# EAGLE design voltage_board - itr2 - V3 (EAGLE 9.6.2)
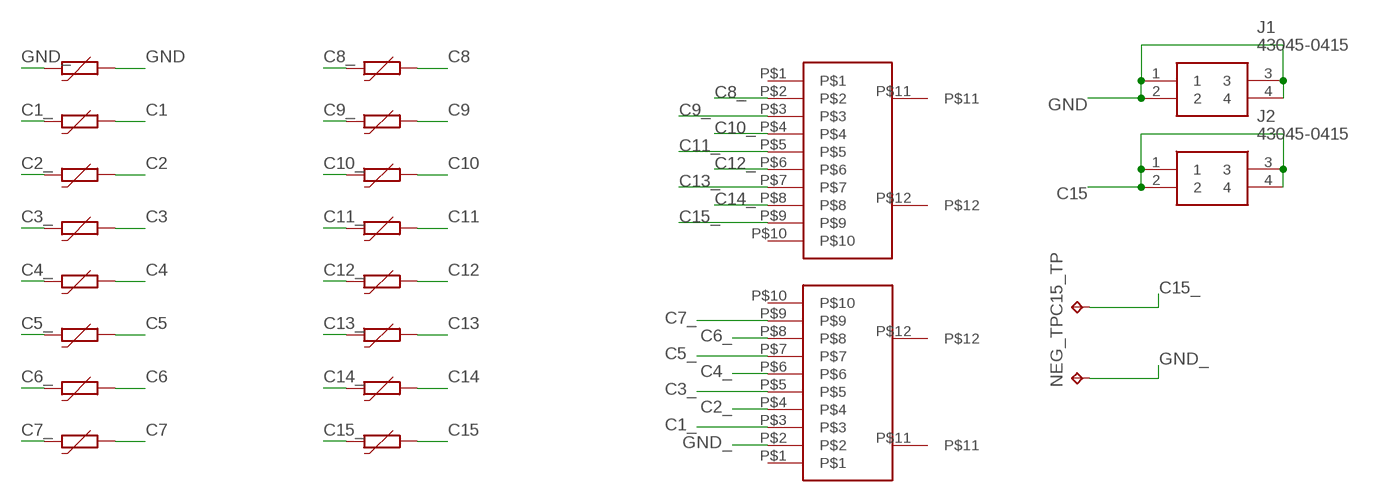
[diagram p0: schematic, sheet 1]

## Parts
C15_TP  TPPAD1-13  [P1-13]
GND_F  PTC-FUSE  [1206]
GND_F1  PTC-FUSE  [1206]
GND_F2  PTC-FUSE  [1206]
GND_F3  PTC-FUSE  [1206]
GND_F4  PTC-FUSE  [1206]
GND_F5  PTC-FUSE  [1206]
GND_F6  PTC-FUSE  [1206]
GND_F7  PTC-FUSE  [1206]
GND_F8  PTC-FUSE  [1206]
GND_F9  PTC-FUSE  [1206]
GND_F10  PTC-FUSE  [1206]
GND_F11  PTC-FUSE  [1206]
GND_F12  PTC-FUSE  [1206]
GND_F13  PTC-FUSE  [1206]
GND_F14  PTC-FUSE  [1206]
GND_F15  PTC-FUSE  [1206]
J1  43045-0415  [43045-04YY_15,16,17]
J2  43045-0415  [43045-04YY_15,16,17]
NEG_TP  TPPAD1-13  [P1-13]
U$37  VERTICALBMS10  [VERTICALBMS10]
U$38  VERTICALBMS10  [VERTICALBMS10]

## Nets
C1: GND_F1.2
C1_: GND_F1.1 U$37.P$3
C2: GND_F2.2
C2_: GND_F2.1 U$37.P$4
C3: GND_F3.2
C3_: GND_F3.1 U$37.P$5
C4: GND_F4.2
C4_: GND_F4.1 U$37.P$6
C5: GND_F5.2
C5_: GND_F5.1 U$37.P$7
C6: GND_F6.2
C6_: GND_F6.1 U$37.P$8
C7: GND_F7.2
C7_: GND_F7.1 U$37.P$9
C8: GND_F8.2
C8_: GND_F8.1 U$38.P$2
C9: GND_F9.2
C9_: GND_F9.1 U$38.P$3
C10: GND_F10.2
C10_: GND_F10.1 U$38.P$4
C11: GND_F11.2
C11_: GND_F11.1 U$38.P$5
C12: GND_F12.2
C12_: GND_F12.1 U$38.P$6
C13: GND_F13.2
C13_: GND_F13.1 U$38.P$7
C14: GND_F14.2
C14_: GND_F14.1 U$38.P$8
C15: GND_F15.2 J2.1 J2.2 J2.3 J2.4
C15_: C15_TP.TP GND_F15.1 U$38.P$9
GND: GND_F.2 J1.1 J1.2 J1.3 J1.4
GND_: GND_F.1 NEG_TP.TP U$37.P$2
Unconnected: U$37.P$1 U$37.P$10 U$37.P$11 U$37.P$12 U$38.P$1 U$38.P$10 U$38.P$11 U$38.P$12

## Library data of the parts
C15_TP NEG_TP = testpad:TP: Test pad
GND_F GND_F1-GND_F15 = IIT_BOMBAY_Racing:PTC-FUSE; MID: 0466.200NRHF
J1 J2 = 43045-0415:43045-0415: Micro-Fit 3.0 Vertical Header, 3.00mm Pitch, Dual Row, 4 Circuits, with PCB Press-fit Metal Retention Clip, Glow-Wire Capable Source: Datasheet <https://www.molex.com/pdm_docs/sd/430450416_sd.pdf>; DESCRIPTION: Micro-Fit 3.0 Vertical Header, 3.00mm Pitch, Dual Row, 4 Circuits, with PCB Press-fit Metal Retention Clip, Glow-Wire Capable; HEIGHT: 9.91mm; MANUFACTURER_NAME: Molex; MANUFACTURER_PART_NUMBER: 43045-0415; MOUSER_PART_NUMBER: 538-43045-0415; MOUSER_PRICE-STOCK: https://www.mouser.co.uk/ProductDetail/Molex/43045-0415?qs=jbJnFeK%2FK6yEAHtN9jCMQg%3D%3D
U$37 U$38 = IIT_BOMBAY_Racing2:VERTICALBMS10

## Board
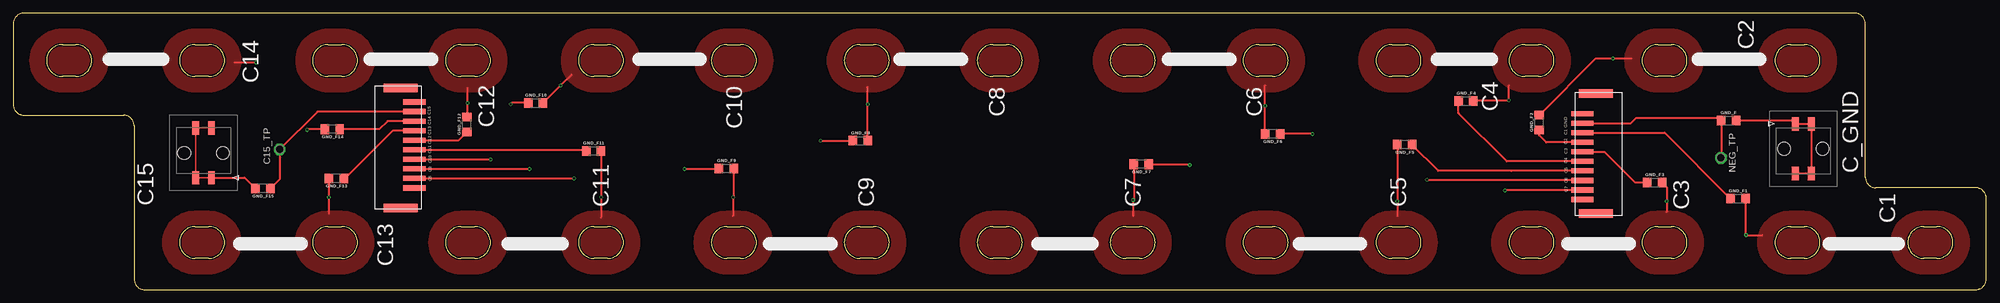
[diagram p1: board, top side]
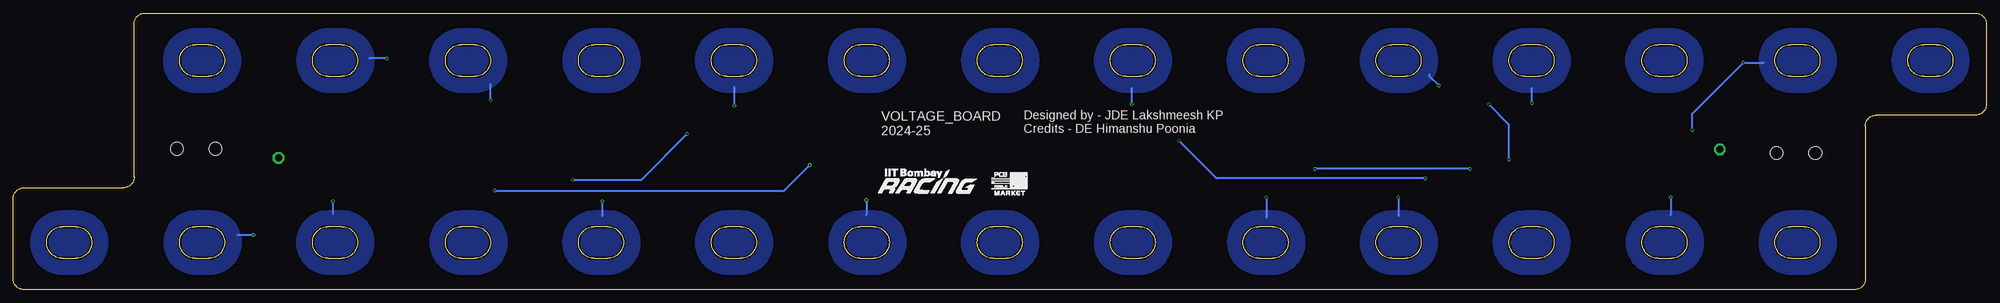
[diagram p2: board, bottom side, seen from below]

Size 372 x 52.1 mm. Coordinates in mm from the lower left corner, seen from the top.
Outline: 335.15,46.2 arc180 335.15,40.2 337.65,40.2 arc180 337.65,46.2 335.15,46.2
Outline: 287.52,40.2 arc180 287.52,46.2 285.02,46.2 arc180 285.02,40.2 287.52,40.2
Outline: 362.72,5.9 arc180 362.72,11.9 360.22,11.9 arc180 360.22,5.9 362.72,5.9
Outline: 312.58,40.2 arc180 312.58,46.2 310.08,46.2 arc180 310.08,40.2 312.58,40.2
Outline: 337.65,5.9 arc180 337.65,11.9 335.15,11.9 arc180 335.15,5.9 337.65,5.9
Outline: 310.08,11.9 arc180 310.08,5.9 312.58,5.9 arc180 312.58,11.9 310.08,11.9
Outline: 262.45,5.9 arc180 262.45,11.9 259.95,11.9 arc180 259.95,5.9 262.45,5.9
Outline: 285.02,11.9 arc180 285.02,5.9 287.52,5.9 arc180 287.52,11.9 285.02,11.9
Outline: 262.45,40.2 arc180 262.45,46.2 259.95,46.2 arc180 259.95,40.2 262.45,40.2
Outline: 34.35,46.2 arc180 34.35,40.2 36.85,40.2 arc180 36.85,46.2 34.35,46.2
Outline: 9.28,46.2 arc180 9.28,40.2 11.78,40.2 arc180 11.78,46.2 9.28,46.2
Outline: 112.05,40.2 arc180 112.05,46.2 109.55,46.2 arc180 109.55,40.2 112.05,40.2
Outline: 237.38,40.2 arc180 237.38,46.2 234.88,46.2 arc180 234.88,40.2 237.38,40.2
Outline: 234.88,11.9 arc180 234.88,5.9 237.38,5.9 arc180 237.38,11.9 234.88,11.9
Outline: 184.75,11.9 arc180 184.75,5.9 187.25,5.9 arc180 187.25,11.9 184.75,11.9
Outline: 134.62,46.2 arc180 134.62,40.2 137.12,40.2 arc180 137.12,46.2 134.62,46.2
Outline: 34.35,11.9 arc180 34.35,5.9 36.85,5.9 arc180 36.85,11.9 34.35,11.9
Outline: 86.98,5.9 arc180 86.98,11.9 84.48,11.9 arc180 84.48,5.9 86.98,5.9
Outline: 209.82,46.2 arc180 209.82,40.2 212.32,40.2 arc180 212.32,46.2 209.82,46.2
Outline: 187.25,40.2 arc180 187.25,46.2 184.75,46.2 arc180 184.75,40.2 187.25,40.2
Outline: 159.68,11.9 arc180 159.68,5.9 162.18,5.9 arc180 162.18,11.9 159.68,11.9
Outline: 112.05,5.9 arc180 112.05,11.9 109.55,11.9 arc180 109.55,5.9 112.05,5.9
Outline: 84.48,46.2 arc180 84.48,40.2 86.98,40.2 arc180 86.98,46.2 84.48,46.2
Outline: 209.82,11.9 arc180 209.82,5.9 212.32,5.9 arc180 212.32,11.9 209.82,11.9
Outline: 137.12,5.9 arc180 137.12,11.9 134.62,11.9 arc180 134.62,5.9 137.12,5.9
Outline: 61.92,40.2 arc180 61.92,46.2 59.42,46.2 arc180 59.42,40.2 61.92,40.2
Outline: 159.68,46.2 arc180 159.68,40.2 162.18,40.2 arc180 162.18,46.2 159.68,46.2
Outline: 59.42,11.9 arc180 59.42,5.9 61.92,5.9 arc180 61.92,11.9 59.42,11.9
Outline: 370,19.2 351.22,19.2 arc-90 349.22,21.2 349.22,50.1 arc90 347.22,52.1 2,52.1 arc90 0,50.1 0,34.9 arc90 2,32.9 20.78,32.9 arc-90 22.78,30.9 22.78,2 arc90 24.78,0 370,0 arc90 372,2 372,17.2 arc90 370,19.2
Copper layers (1*16): Top 0.035mm / dielectric 1.5mm / Bottom 0.035mm
Design rules "PCB_Power": minimum track width 5mil, minimum drill 10mil, track to track 5mil, track to pad 5mil, pad to pad 5mil, via to via 5mil, smd to smd 5mil, copper to edge 10mil, drill to drill 6mil, minimum pad ring 5mil, minimum via ring 5mil, stop-mask expansion 3mil, vias tented up to drill 0mil, thermal gap 10mil

### Footprints (pad centres in the part's own frame; a part is rotated, then mirrored left to right if it is on the bottom)
P1-13 = drill 1.321 pad 2.159 octagon: TP 0,0
1206 = smd 1.6 x 1.8: 1 -1.4,0; 2 1.4,0
43045-04YY_15,16,17 = smd 1.27 x 2.54: 1 1.5,-4.7; 2 -1.5,-4.7; 3 1.5,4.7; 4 -1.5,4.7 | hole 2.41: 3.65,0; -3.65,0
VERTICALBMS10 = smd 0.97 x 4.2: P$1 -8.786,3.95; P$2 -6.986,3.95; P$3 -5.186,3.95; P$4 -3.386,3.95; P$5 -1.586,3.95; P$6 0.214,3.95; P$7 2.014,3.95; P$8 3.814,3.95; P$9 5.614,3.95; P$10 7.414,3.95 | smd 1.6 x 6.4: P$11 -12.54,6.508; P$12 10.08,6.508

### Placement (x,y rotation side)
C15_TP  50.24,26.43 90 top
GND_F  323.41,31.89 0 top
GND_F1  325.19,17.16 0 top
GND_F2  287.73,31.51 90 top
GND_F3  309.44,20.21 0 top
GND_F4  273.88,35.58 0 top
GND_F5  262.33,27.32 180 top
GND_F6  237.44,29.35 180 top
GND_F7  212.67,23.64 180 top
GND_F8  159.71,28.08 0 top
GND_F9  134.44,22.88 0 top
GND_F10  98.5,35.19 0 top
GND_F11  109.42,26.18 0 top
GND_F12  85.54,31.13 90 top
GND_F13  60.91,20.97 180 top
GND_F14  60.14,30.24 180 top
GND_F15  47.06,19.07 180 top
J1  337.51,26.56 180 top
J2  35.89,25.8 0 top
NEG_TP  321.97,24.86 90 top
U$8  LOGO_PCBPOWER  [270X170]  187.63,17.77 0 bottom
U$23  [IITBR_LOGO_180DIFF]  209.77,17.67 0 bottom
U$37  291.92,24.4 270 top
U$38  79.57,27.96 90 top

### Tracks (layer width: path | path; a pad name or v marks a point on that pad's centre or on a via)
C1  (via drill 0.35)
  Top 0.406: 329.76,10.3 v326.72,10.3 326.59,10.3 GND_F1.2
  Bottom 0.406: v326.72,10.3 329.76,10.3
  pour Bottom: 362.83,2.91 360.04,2.91 arc-180 360.04,14.85 362.83,14.85 arc-180
  pour Bottom: 362.83,2.91 360.04,2.91 arc-180 360.04,14.85 362.83,14.85 arc-180
  pour Top: 362.83,2.91 360.04,2.91 arc-180 360.04,14.85 362.83,14.85 arc-180
  pour Top: 337.69,2.91 334.89,2.91 arc-180 334.89,14.85 337.69,14.85 arc-180
  pour Bottom: 337.69,2.91 334.89,2.91 arc-180 334.89,14.85 337.69,14.85 arc-180
C1_
  Top 0.406: GND_F1.1 311.37,29.59 U$37.P$3
C2  (via drill 0.35)
  Top 0.406: GND_F2.2 298.39,43.58 v301.57,43.58 305.13,43.58
  Bottom 0.406: v301.57,43.58 304.87,43.58
  pour Top: 337.79,37.23 335,37.23 arc-180 335,49.16 337.79,49.16 arc-180
  pour Top: 312.64,37.23 309.85,37.23 arc-180 309.85,49.16 312.64,49.16 arc-180
  pour Bottom: 337.79,37.23 335,37.23 arc-180 335,49.16 337.79,49.16 arc-180
  pour Bottom: 312.64,37.23 309.85,37.23 arc-180 309.85,49.16 312.64,49.16 arc-180
C2_
  Top 0.406: U$37.P$4 289.04,27.79 287.73,29.09 GND_F2.1
C3  (via drill 0.35)
  Top 0.406: 311.73,14.62 v311.73,16.65 311.73,19.32 GND_F3.2
  Bottom 0.406: v311.73,16.65 311.73,14.37
  pour Top: 312.67,2.91 309.88,2.91 arc-180 309.88,14.85 312.67,14.85 arc-180
  pour Top: 287.52,2.91 284.73,2.91 arc-180 284.73,14.85 287.52,14.85 arc-180
  pour Bottom: 312.67,2.91 309.88,2.91 arc-180 309.88,14.85 312.67,14.85 arc-180
  pour Bottom: 287.52,2.91 284.73,2.91 arc-180 284.73,14.85 287.52,14.85 arc-180
C3_
  Top 0.406: U$37.P$5 299.98,25.98 305.76,20.21 GND_F3.1
C4  (via drill 0.35)
  Top 0.406: GND_F4.2 281.88,35.58 v282.01,35.7 282.01,38.5
  Bottom 0.406: v282.01,35.7 282.01,38.75
  pour Top: 287.63,37.23 284.83,37.23 arc-180 284.83,49.16 287.63,49.16 arc-180
  pour Top: 262.48,37.23 259.69,37.23 arc-180 259.69,49.16 262.48,49.16 arc-180
  pour Bottom: 287.63,37.23 284.83,37.23 arc-180 284.83,49.16 287.63,49.16 arc-180
  pour Bottom: 262.48,37.23 259.69,37.23 arc-180 259.69,49.16 262.48,49.16 arc-180
C4_
  Top 0.406: GND_F4.1 272.48,33.29 281.59,24.19 U$37.P$6
C5  (via drill 0.35)
  Top 0.406: 260.93,13.86 v260.93,16.65 GND_F5.2
  Bottom 0.406: v260.93,16.65 260.93,13.86
  pour Top: 262.5,2.91 259.71,2.91 arc-180 259.71,14.85 262.5,14.85 arc-180
  pour Top: 237.49,2.91 234.69,2.91 arc-180 234.69,14.85 237.49,14.85 arc-180
  pour Bottom: 262.5,2.91 259.71,2.91 arc-180 259.71,14.85 262.5,14.85 arc-180
  pour Bottom: 237.49,2.91 234.69,2.91 arc-180 234.69,14.85 237.49,14.85 arc-180
C5_
  Top 0.406: U$37.P$7 282.52,22.39 282.38,22.39 268.66,22.39 GND_F5.1
C6  (via drill 0.35)
  Top 0.406: 236.04,38.5 v236.04,34.69 v236.03,34.68 GND_F6.2
  Bottom 0.406: v236.04,34.69 236.04,38.24
  pour Top: 237.46,37.23 234.67,37.23 arc-180 234.67,49.16 237.46,49.16 arc-180
  pour Top: 212.44,37.23 209.65,37.23 arc-180 209.65,49.16 212.44,49.16 arc-180
  pour Bottom: 237.46,37.23 234.67,37.23 arc-180 234.67,49.16 237.46,49.16 arc-180
  pour Bottom: 212.44,37.23 209.65,37.23 arc-180 209.65,49.16 212.44,49.16 arc-180
C6_  (via drill 0.35)
  Top 0.406: v266.52,20.72 266.65,20.59 U$37.P$8 | v244.93,29.35 GND_F6.1
  Bottom 0.406: v266.52,20.72 253.56,20.72 v244.93,29.35
C7  (via drill 0.35)
  Top 0.406: 211.15,13.86 v211.15,16.91 211.27,17.03 GND_F7.2
  Bottom 0.406: v211.15,16.91 211.15,14.11
  pour Top: 212.34,2.91 209.55,2.91 arc-180 209.55,14.85 212.34,14.85 arc-180
  pour Top: 187.32,2.91 184.53,2.91 arc-180 184.53,14.85 187.32,14.85 arc-180
  pour Bottom: 212.34,2.91 209.55,2.91 arc-180 209.55,14.85 212.34,14.85 arc-180
  pour Bottom: 187.32,2.91 184.53,2.91 arc-180 184.53,14.85 187.32,14.85 arc-180
C7_  (via drill 0.35)
  Top 0.406: U$37.P$9 281.35,18.79 v281.25,18.68 | v221.81,23.51 214.2,23.51 GND_F7.1
  Bottom 0.406: v281.25,18.68 226.64,18.68 v221.81,23.51
C8  (via drill 0.35)
  Top 0.406: 161.11,38.24 v161.11,34.94 GND_F8.2
  Bottom 0.406: v161.11,34.94 161.11,37.99
  pour Top: 187.3,37.23 184.5,37.23 arc-180 184.5,49.16 187.3,49.16 arc-180
  pour Top: 162.28,37.23 159.48,37.23 arc-180 159.48,49.16 162.28,49.16 arc-180
  pour Bottom: 187.3,37.23 184.5,37.23 arc-180 184.5,49.16 187.3,49.16 arc-180
  pour Bottom: 162.28,37.23 159.48,37.23 arc-180 159.48,49.16 162.28,49.16 arc-180
C8_  (via drill 0.35)
  Top 0.406: v105.74,20.97 v105.73,20.97 U$38.P$2 | v152.22,28.08 GND_F8.1
  Bottom 0.406: v105.74,20.97 145.11,20.97 v152.22,28.08
C9  (via drill 0.35)
  Top 0.406: v135.71,17.41 135.71,17.16 | 135.71,17.16 135.71,13.86 | GND_F9.2 135.84,17.29 135.71,17.16
  Bottom 0.406: v135.71,17.41 135.71,13.6
  pour Top: 162.3,2.91 159.51,2.91 arc-180 159.51,14.85 162.3,14.85 arc-180
  pour Top: 137.16,2.91 134.36,2.91 arc-180 134.36,14.85 137.16,14.85 arc-180
  pour Bottom: 162.3,2.91 159.51,2.91 arc-180 159.51,14.85 162.3,14.85 arc-180
  pour Bottom: 137.16,2.91 134.36,2.91 arc-180 134.36,14.85 137.16,14.85 arc-180
C9_  (via drill 0.35)
  Top 0.406: U$38.P$3 97.33,22.77 v97.35,22.75 | v126.56,22.75 132.91,22.75 GND_F9.1
  Bottom 0.406: v97.35,22.75 v126.56,22.75
C10  (via drill 0.35)
  Top 0.406: GND_F10.2 v103.2,38.49 v103.2,38.5 105.23,40.53
  Bottom 0.406: v103.2,38.5 104.97,40.27 104.97,40.53
  pour Top: 137.26,37.23 134.46,37.23 arc-180 134.46,49.16 137.26,49.16 arc-180
  pour Top: 112.11,37.23 109.32,37.23 arc-180 109.32,49.16 112.11,49.16 arc-180
  pour Bottom: 137.26,37.23 134.46,37.23 arc-180 134.46,49.16 137.26,49.16 arc-180
  pour Bottom: 112.11,37.23 109.32,37.23 arc-180 109.32,49.16 112.11,49.16 arc-180
C10_  (via drill 0.35)
  Top 0.406: U$38.P$4 89.94,24.57 v89.99,24.53 | v93.8,34.94 94.05,35.19 GND_F10.1
  Bottom 0.406: v89.99,24.53 89.99,31.13 v93.8,34.94
C11  (via drill 0.35)
  Top 0.406: 110.82,13.6 v110.82,17.41 v110.82,17.42 GND_F11.2
  Bottom 0.406: v110.82,17.41 110.82,13.86
  pour Top: 112.14,2.91 109.34,2.91 arc-180 109.34,14.85 112.14,14.85 arc-180
  pour Top: 87.12,2.91 84.32,2.91 arc-180 84.32,14.85 87.12,14.85 arc-180
  pour Bottom: 112.14,2.91 109.34,2.91 arc-180 109.34,14.85 112.14,14.85 arc-180
  pour Bottom: 87.12,2.91 84.32,2.91 arc-180 84.32,14.85 87.12,14.85 arc-180
C11_
  Top 0.406: GND_F11.1 107.83,26.37 U$38.P$5
C12  (via drill 0.35)
  Top 0.406: GND_F12.2 85.67,32.66 v85.67,35.19 85.67,37.99
  Bottom 0.406: v85.67,35.19 85.67,37.99
  pour Top: 87.09,37.23 84.3,37.23 arc-180 84.3,49.16 87.09,49.16 arc-180
  pour Top: 62.07,37.23 59.28,37.23 arc-180 59.28,49.16 62.07,49.16 arc-180
  pour Bottom: 87.09,37.23 84.3,37.23 arc-180 84.3,49.16 87.09,49.16 arc-180
  pour Bottom: 62.07,37.23 59.28,37.23 arc-180 59.28,49.16 62.07,49.16 arc-180
C12_
  Top 0.406: U$38.P$6 83.98,28.17 GND_F12.1
C13  (via drill 0.35)
  Top 0.406: GND_F13.2 v59.5,17.42 v59.51,17.41 59.51,14.37
  Bottom 0.406: v59.51,17.41 59.51,14.11
  pour Top: 61.97,2.91 59.18,2.91 arc-180 59.18,14.85 61.97,14.85 arc-180
  pour Top: 36.95,2.91 34.16,2.91 arc-180 34.16,14.85 36.95,14.85 arc-180
  pour Bottom: 61.97,2.91 59.18,2.91 arc-180 59.18,14.85 61.97,14.85 arc-180
  pour Bottom: 36.95,2.91 34.16,2.91 arc-180 34.16,14.85 36.95,14.85 arc-180
C13_
  Top 0.406: U$38.P$7 71.56,29.97 62.56,20.97 GND_F13.1
C14  (via drill 0.35)
  Top 0.406: v45.79,42.81 41.73,42.81 | v55.44,30.11 55.57,30.24 GND_F14.2
  Bottom 0.406: 41.98,42.81 v45.79,42.81 55.44,33.16 v55.44,30.11
  pour Top: 36.93,37.23 34.13,37.23 arc-180 34.13,49.16 36.93,49.16 arc-180
  pour Top: 11.91,37.23 9.11,37.23 arc-180 9.11,49.16 11.91,49.16 arc-180
  pour Bottom: 36.93,37.23 34.13,37.23 arc-180 34.13,49.16 36.93,49.16 arc-180
  pour Bottom: 11.91,37.23 9.11,37.23 arc-180 9.11,49.16 11.91,49.16 arc-180
C14_
  Top 0.406: U$38.P$8 70.56,31.77 69.03,30.24 GND_F14.1
C15
  Top 0.305: 38.04,30.5 J2.3 J2.4 J2.2 J2.1
  Top 0.406: J2.1 43.63,21.1 GND_F15.2
C15_
  Top 0.406: U$38.P$9 57.38,33.57 C15_TP.TP 50.24,20.84 GND_F15.1
GND
  Top 0.406: GND_F.2 335.38,31.89 J1.1 J1.2 J1.4 J1.3
GND_
  Top 0.406: U$37.P$2 305,31.39 306.01,32.4 321.51,32.4 GND_F.1 322.01,24.9 NEG_TP.TP

### Text on the board
tNames: C2 | C14 | C_GND | C4 | C15 | C8 | C6 | C14 | C12 | GND | C10 | C13 | C1 | C12 | C2 | C11 | C3 | C10 | C4 | C9 | C5 | C8 | C6 | C7 | C15 | C11 | C9 | C7 | C5 | C3 | C1 | C13
bNames: Designed by - JDE Lakshmeesh KP / Credits - DE Himanshu Poonia | VOLTAGE_BOARD / 2024-25